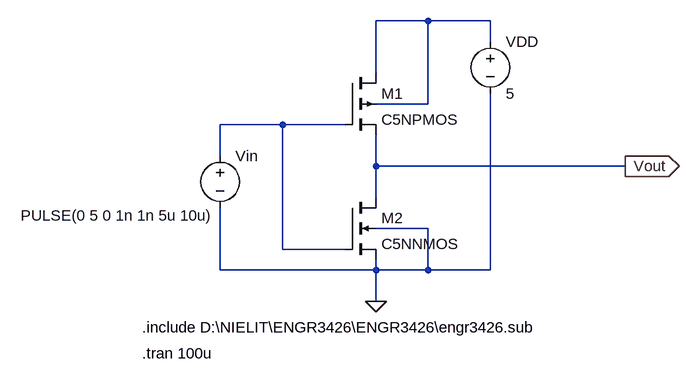
[diagram p0: schematic NOT.asc]
NOT.asc, the LTspice schematic file:
Version 4
SHEET 1 880 680
WIRE 304 -32 224 -32
WIRE 400 -32 304 -32
WIRE 400 0 400 -32
WIRE 224 48 224 -32
WIRE 304 96 304 -32
WIRE 304 96 224 96
WIRE 80 128 -16 128
WIRE 176 128 80 128
WIRE -16 176 -16 128
WIRE 224 192 224 144
WIRE 608 192 224 192
WIRE 224 240 224 192
WIRE 304 288 224 288
WIRE 80 320 80 128
WIRE 176 320 80 320
WIRE -16 352 -16 256
WIRE 224 352 224 336
WIRE 224 352 -16 352
WIRE 304 352 304 288
WIRE 304 352 224 352
WIRE 400 352 400 80
WIRE 400 352 304 352
WIRE 224 400 224 352
FLAG 224 400 0
FLAG 608 192 Vout
IOPIN 608 192 Out
SYMBOL pmos4 176 48 R0
SYMATTR InstName M1
SYMATTR Value C5NPMOS
SYMATTR Value2 l=0.6u w=7.2u
SYMBOL nmos4 176 240 R0
SYMATTR InstName M2
SYMATTR Value C5NNMOS
SYMATTR Value2 l=0.6u w=3.6u
SYMBOL voltage 400 -16 R0
SYMATTR InstName VDD
SYMATTR Value 5
SYMBOL voltage -16 160 R0
WINDOW 3 -307 108 Left 2
WINDOW 123 0 0 Left 0
WINDOW 39 0 0 Left 0
SYMATTR Value PULSE(0 5 0 1n 1n 5u 10u)
SYMATTR InstName Vin
TEXT -136 440 Left 2 !.include D:\\NIELIT\\ENGR3426\\ENGR3426\\engr3426.sub
TEXT -136 480 Left 2 !.tran 100u

The netlist it stands for:
* NOT.asc
M1 N001 N002 Vout N001 C5NPMOS l=0.6u w=7.2u
M2 Vout N002 0 0 C5NNMOS l=0.6u w=3.6u
VDD N001 0 5
Vin N002 0 PULSE(0 5 0 1n 1n 5u 10u)
.model NMOS NMOS
.model PMOS PMOS
.lib standard.mos
.include D:\NIELIT\ENGR3426\ENGR3426\engr3426.sub
.tran 100u
.backanno
.end